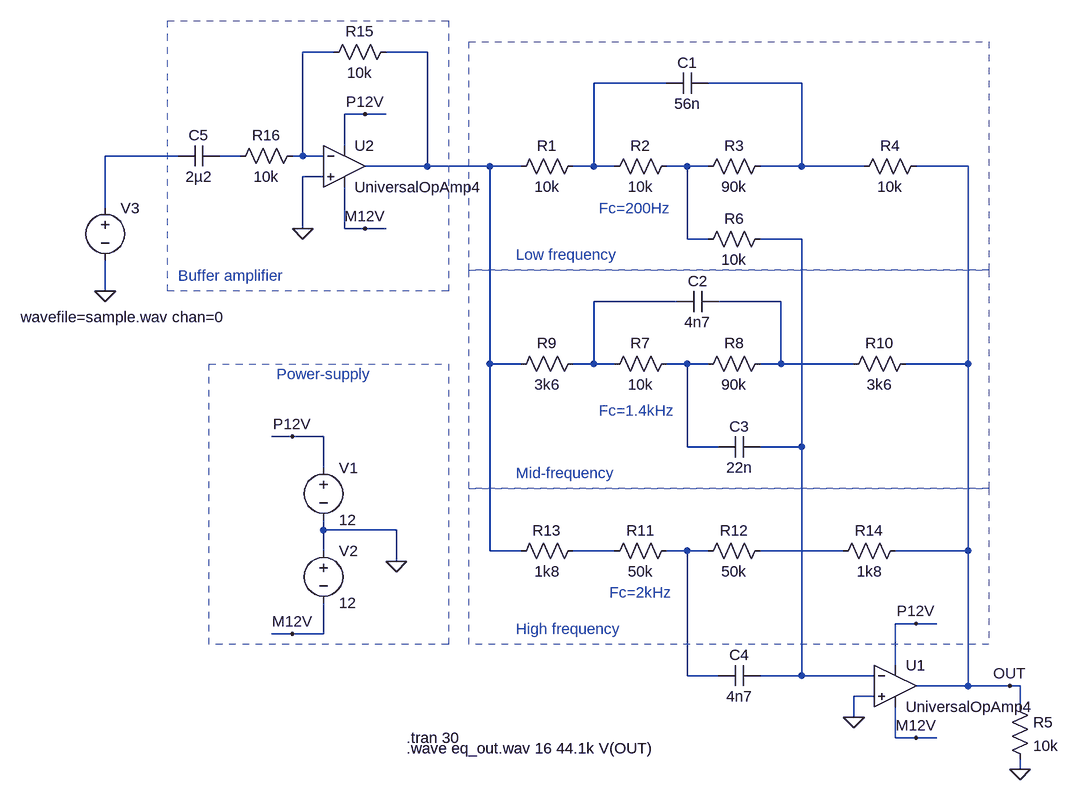
[diagram p0: schematic 3_band_eq_sound.asc]
3_band_eq_sound.asc, the LTspice schematic file:
Version 4
SHEET 1 1980 1040
WIRE 432 -112 384 -112
WIRE 576 -112 512 -112
WIRE 944 -64 832 -64
WIRE 1152 -64 1008 -64
WIRE 480 -16 448 -16
WIRE 512 -16 480 -16
WIRE 448 32 448 -16
WIRE 192 48 80 48
WIRE 288 48 256 48
WIRE 384 48 384 -112
WIRE 384 48 368 48
WIRE 416 48 384 48
WIRE 576 64 576 -112
WIRE 576 64 480 64
WIRE 672 64 576 64
WIRE 720 64 672 64
WIRE 832 64 832 -64
WIRE 832 64 800 64
WIRE 864 64 832 64
WIRE 976 64 944 64
WIRE 1008 64 976 64
WIRE 1152 64 1152 -64
WIRE 1152 64 1088 64
WIRE 1248 64 1152 64
WIRE 1408 64 1328 64
WIRE 416 80 384 80
WIRE 80 128 80 48
WIRE 384 160 384 80
WIRE 448 160 448 96
WIRE 480 160 448 160
WIRE 512 160 480 160
WIRE 976 176 976 64
WIRE 1008 176 976 176
WIRE 1152 176 1088 176
WIRE 80 256 80 208
WIRE 960 272 832 272
WIRE 1120 272 1024 272
WIRE 672 368 672 64
WIRE 720 368 672 368
WIRE 832 368 832 272
WIRE 832 368 800 368
WIRE 864 368 832 368
WIRE 976 368 944 368
WIRE 1008 368 976 368
WIRE 1120 368 1120 272
WIRE 1120 368 1088 368
WIRE 1232 368 1120 368
WIRE 1408 368 1408 64
WIRE 1408 368 1312 368
WIRE 368 480 336 480
WIRE 416 480 368 480
WIRE 976 496 976 368
WIRE 1024 496 976 496
WIRE 1152 496 1152 176
WIRE 1152 496 1088 496
WIRE 416 528 416 480
WIRE 416 624 416 608
WIRE 528 624 416 624
WIRE 416 656 416 624
WIRE 672 656 672 368
WIRE 720 656 672 656
WIRE 864 656 800 656
WIRE 976 656 944 656
WIRE 1008 656 976 656
WIRE 1216 656 1088 656
WIRE 1408 656 1408 368
WIRE 1408 656 1296 656
WIRE 528 672 528 624
WIRE 1328 768 1296 768
WIRE 1360 768 1328 768
WIRE 368 784 336 784
WIRE 416 784 416 736
WIRE 416 784 368 784
WIRE 1296 832 1296 768
WIRE 976 848 976 656
WIRE 1024 848 976 848
WIRE 1152 848 1152 496
WIRE 1152 848 1088 848
WIRE 1264 848 1152 848
WIRE 1408 864 1408 656
WIRE 1408 864 1328 864
WIRE 1472 864 1408 864
WIRE 1488 864 1472 864
WIRE 1264 880 1232 880
WIRE 1488 896 1488 864
WIRE 1232 912 1232 880
WIRE 1296 944 1296 896
WIRE 1328 944 1296 944
WIRE 1360 944 1328 944
WIRE 1488 992 1488 976
FLAG 528 672 0
FLAG 368 480 P12V
FLAG 368 784 M12V
FLAG 80 256 0
FLAG 1232 912 0
FLAG 1488 992 0
FLAG 1328 768 P12V
FLAG 1328 944 M12V
FLAG 480 -16 P12V
FLAG 480 160 M12V
FLAG 384 160 0
FLAG 1472 864 OUT
SYMBOL voltage 416 512 R0
WINDOW 123 0 0 Left 0
WINDOW 39 0 0 Left 0
SYMATTR InstName V1
SYMATTR Value 12
SYMBOL voltage 416 640 R0
WINDOW 123 0 0 Left 0
WINDOW 39 0 0 Left 0
SYMATTR InstName V2
SYMATTR Value 12
SYMBOL voltage 80 112 R0
WINDOW 3 -130 184 Left 2
SYMATTR Value wavefile=sample.wav chan=0
SYMATTR InstName V3
SYMBOL res 816 48 R90
WINDOW 0 0 56 VBottom 2
WINDOW 3 32 56 VTop 2
SYMATTR InstName R1
SYMATTR Value 10k
SYMBOL res 960 48 R90
WINDOW 0 0 56 VBottom 2
WINDOW 3 32 56 VTop 2
SYMATTR InstName R2
SYMATTR Value 10k
SYMBOL res 1104 48 R90
WINDOW 0 0 56 VBottom 2
WINDOW 3 32 56 VTop 2
SYMATTR InstName R3
SYMATTR Value 90k
SYMBOL res 1344 48 R90
WINDOW 0 0 56 VBottom 2
WINDOW 3 32 56 VTop 2
SYMATTR InstName R4
SYMATTR Value 10k
SYMBOL cap 1008 -80 R90
WINDOW 0 0 32 VBottom 2
WINDOW 3 32 32 VTop 2
SYMATTR InstName C1
SYMATTR Value 56n
SYMBOL res 1472 880 R0
SYMATTR InstName R5
SYMATTR Value 10k
SYMBOL OpAmps\\UniversalOpAmp4 1296 864 R0
SYMATTR InstName U1
SYMBOL res 1104 160 R90
WINDOW 0 0 56 VBottom 2
WINDOW 3 32 56 VTop 2
SYMATTR InstName R6
SYMATTR Value 10k
SYMBOL res 960 352 R90
WINDOW 0 0 56 VBottom 2
WINDOW 3 32 56 VTop 2
SYMATTR InstName R7
SYMATTR Value 10k
SYMBOL res 1104 352 R90
WINDOW 0 0 56 VBottom 2
WINDOW 3 32 56 VTop 2
SYMATTR InstName R8
SYMATTR Value 90k
SYMBOL cap 1024 256 R90
WINDOW 0 0 32 VBottom 2
WINDOW 3 32 32 VTop 2
SYMATTR InstName C2
SYMATTR Value 4n7
SYMBOL cap 1088 480 R90
WINDOW 0 0 32 VBottom 2
WINDOW 3 32 32 VTop 2
SYMATTR InstName C3
SYMATTR Value 22n
SYMBOL res 816 352 R90
WINDOW 0 0 56 VBottom 2
WINDOW 3 32 56 VTop 2
SYMATTR InstName R9
SYMATTR Value 3k6
SYMBOL res 1328 352 R90
WINDOW 0 0 56 VBottom 2
WINDOW 3 32 56 VTop 2
SYMATTR InstName R10
SYMATTR Value 3k6
SYMBOL res 960 640 R90
WINDOW 0 0 56 VBottom 2
WINDOW 3 32 56 VTop 2
SYMATTR InstName R11
SYMATTR Value 50k
SYMBOL res 1104 640 R90
WINDOW 0 0 56 VBottom 2
WINDOW 3 32 56 VTop 2
SYMATTR InstName R12
SYMATTR Value 50k
SYMBOL res 816 640 R90
WINDOW 0 0 56 VBottom 2
WINDOW 3 32 56 VTop 2
SYMATTR InstName R13
SYMATTR Value 1k8
SYMBOL res 1312 640 R90
WINDOW 0 0 56 VBottom 2
WINDOW 3 32 56 VTop 2
SYMATTR InstName R14
SYMATTR Value 1k8
SYMBOL cap 1088 832 R90
WINDOW 0 0 32 VBottom 2
WINDOW 3 32 32 VTop 2
SYMATTR InstName C4
SYMATTR Value 4n7
SYMBOL OpAmps\\UniversalOpAmp4 448 64 R0
SYMATTR InstName U2
SYMBOL res 528 -128 R90
WINDOW 0 0 56 VBottom 2
WINDOW 3 32 56 VTop 2
SYMATTR InstName R15
SYMATTR Value 10k
SYMBOL res 384 32 R90
WINDOW 0 0 56 VBottom 2
WINDOW 3 32 56 VTop 2
SYMATTR InstName R16
SYMATTR Value 10k
SYMBOL cap 256 32 R90
WINDOW 0 0 32 VBottom 2
WINDOW 3 32 32 VTop 2
SYMATTR InstName C5
SYMATTR Value 2µ2
TEXT 544 944 Left 2 !.tran 30
TEXT 840 128 Left 2 ;Fc=200Hz
TEXT 840 440 Left 2 ;Fc=1.4kHz
TEXT 856 720 Left 2 ;Fc=2kHz
TEXT 712 200 Left 2 ;Low frequency
TEXT 712 536 Left 2 ;Mid-frequency
TEXT 712 776 Left 2 ;High frequency
TEXT 192 232 Left 2 ;Buffer amplifier
TEXT 544 960 Left 2 !.wave eq_out.wav 16 44.1k V(OUT)
TEXT 344 384 Left 2 ;Power-supply
RECTANGLE Normal 1440 224 640 -128 2
RECTANGLE Normal 1440 560 640 224 2
RECTANGLE Normal 1440 800 640 560 2
RECTANGLE Normal 608 256 176 -160 2
RECTANGLE Normal 608 800 240 368 2

The netlist it stands for:
* 3_band_eq_sound.asc
V1 P12V 0 12
V2 0 M12V 12
V3 N005 0 wavefile=sample.wav chan=0
R1 N003 N002 10k
R2 N007 N003 10k
R3 N004 N007 90k
R4 OUT N004 10k
C1 N004 N003 56n
R5 OUT 0 10k
* U1: UniversalOpAmp4 (symbol OpAmps\UniversalOpAmp4 not available, pins judged from their places): In+=0 In-=N008 V+=P12V V-=M12V OUT=OUT
R6 N008 N007 10k
R7 N011 N009 10k
R8 N010 N011 90k
C2 N010 N009 4n7
C3 N008 N011 22n
R9 N009 N002 3k6
R10 OUT N010 3k6
R11 N013 N012 50k
R12 N014 N013 50k
R13 N012 N002 1k8
R14 OUT N014 1k8
C4 N008 N013 4n7
* U2: UniversalOpAmp4 (symbol OpAmps\UniversalOpAmp4 not available, pins judged from their places): In+=0 In-=N001 V+=P12V V-=M12V OUT=N002
R15 N002 N001 10k
R16 N001 N006 10k
C5 N006 N005 2µ2
.tran 30
* Fc=200Hz
* Fc=1.4kHz
* Fc=2kHz
* Low frequency
* Mid-frequency
* High frequency
* Buffer amplifier
.wave eq_out.wav 16 44.1k V(OUT)
* Power-supply
.backanno
.end